# Altium schematic sheet L-Stick_sheet5_power_supply.SchDoc: L-Stick - Power Supply
size A4; DocumentNumber: 5; Revision: 1.0.0; SheetNumber: 5; SheetTotal: 5; DrawnBy: SU; DocumentSize: A4; PCAName: L-Stick
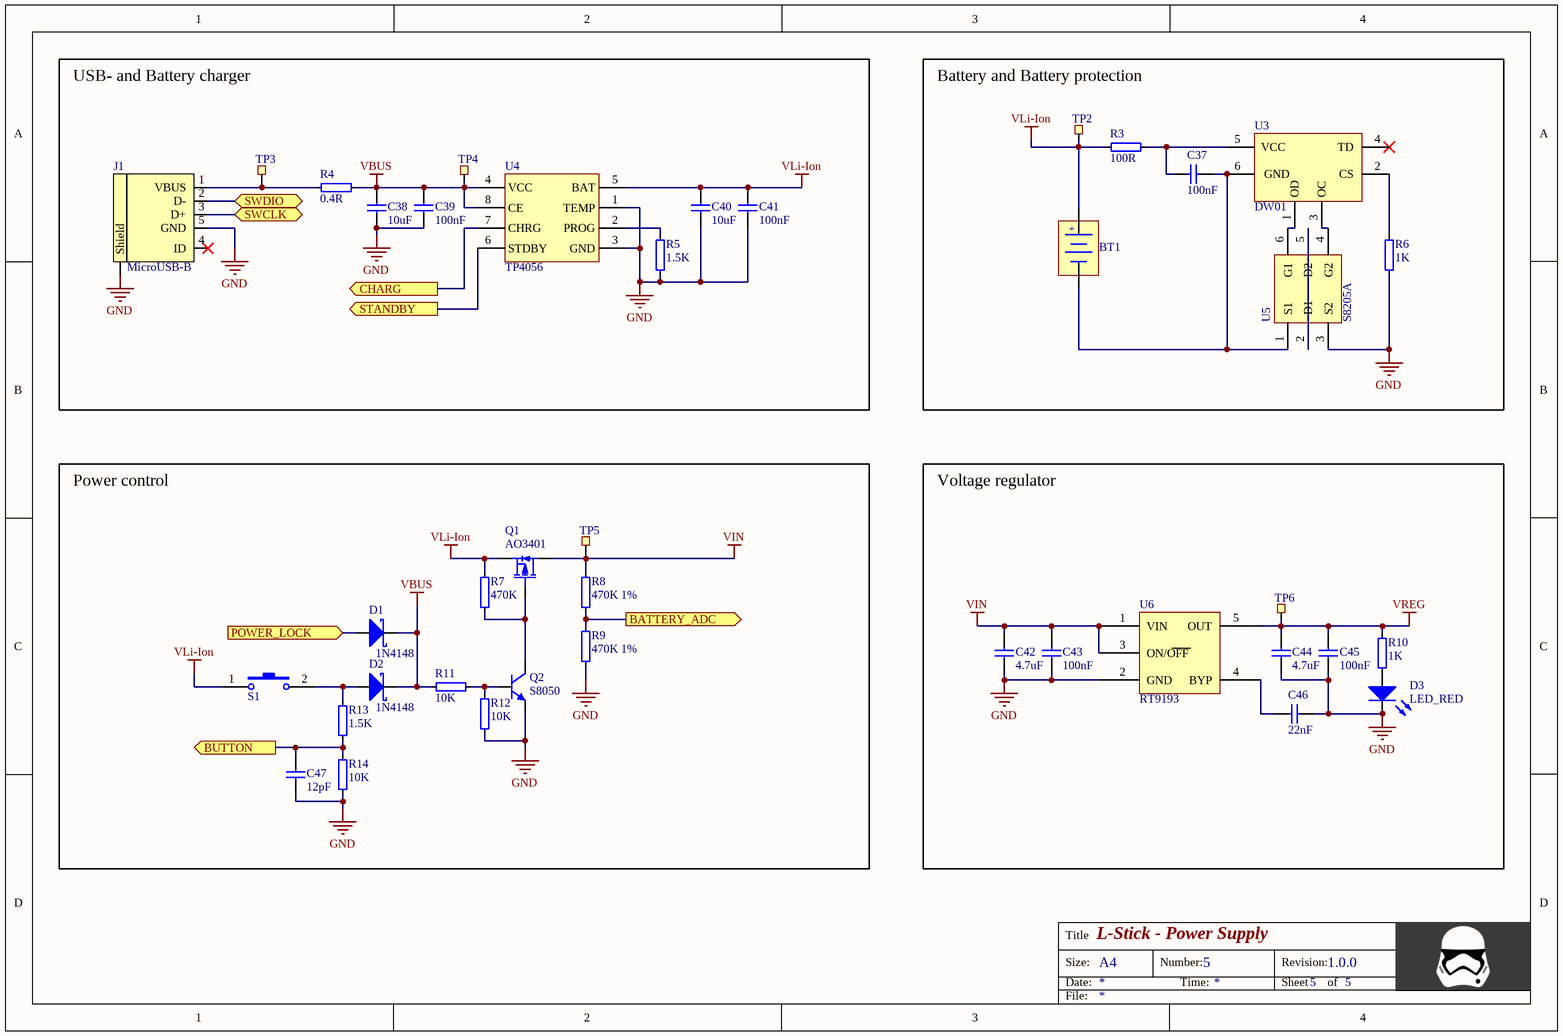
[diagram p0: L-Stick_sheet5_power_supply.SchDoc]

## Parts
BT1  XH2.54_2PIN  [XH2.54_2PIN]  (value not drawn)
C37  100nF  [0402C]
C38  10uF  [0603C]
C39  100nF  [0402C]
C40  10uF  [0603C]
C41  100nF  [0402C]
C42  4.7uF  [0603C]
C43  100nF  [0402C]
C44  4.7uF  [0603C]
C45  100nF  [0402C]
C46  22nF  [0402C]
C47  12pF  [0402C]
D1  1N4148  [SOD-523]
D2  1N4148  [SOD-523]
D3  LED_RED  [LED_RED_0603]
J1  MicroUSB-B  [USB-Micro]
Q1  AO3401  [SOT-23A]
Q2  S8050  [SOT-23A]
R3  100R  [0402R]
R4  0.4R  [1206R]
R5  1.5K  [0402R]
R6  1K  [0402R]
R7  470K  [0402R]
R8  470K 1%  [0402R]
R9  470K 1%  [0402R]
R10  1K  [0402R]
R11  10K  [0402R]
R12  10K  [0402R]
R13  1.5K  [0402R]
R14  10K  [0402R]
S1  Side Button  [SW_SIDE]  (value not drawn)
TP2  Ø1.5mm,SMD  [TP_SMD]  (value not drawn)  (no BOM)
TP3  Ø1.5mm,SMD  [TP_SMD]  (value not drawn)  (no BOM)
TP4  Ø1.5mm,SMD  [TP_SMD]  (value not drawn)  (no BOM)
TP5  Ø1.5mm,SMD  [TP_SMD]  (value not drawn)  (no BOM)
TP6  Ø1.5mm,SMD  [TP_SMD]  (value not drawn)  (no BOM)
U3  DW01  [SOT23-6]
U4  TP4056  [SOIC8E]
U5  S8205A  [SOT23-6]
U6  RT9193  [SOT23-5]

## Blocks framed on the sheet
USB- and Battery charger: C38-C41 J1 R4 R5 TP3 TP4 U4
Battery and Battery protection: BT1 C37 R3 R6 TP2 U3 U5
Power control: C47 D1 D2 Q1 Q2 R7-R9 R11-R14 S1 TP5
Voltage regulator: C42-C46 D3 R10 TP6 U6

## Ports
BATTERY_ADC (out), BUTTON (out), CHARG (out), POWER_LOCK (in), STANDBY (out), SWCLK (bidir), SWDIO (bidir)

## Nets
GND: C38.1 C39.1 C40.1 C41.1 C42.1 C43.1 C44.1 C45.1 C46.2 C47.1 D3.2(K) J1.5(GND) J1.6(Shield) Q2.2(E) R5.1 R6.1 R9.2 R12.2 R14.1 U4.1(TEMP) U4.3(GND) U5.3(S2) U6.2(GND)
VBUS: C38.2 C39.2 D1.2(K) D2.2(K) R4.2 R11.2 TP4.1 U4.4(VCC) U4.8(CE)
VIN: C42.2 C43.2 Q1.3(D) R8.1 TP5.1 U6.1(VIN) U6.3(ON/OFF)
VLi-Ion: BT1.1(+) C40.2 C41.2 Q1.2(S) R3.1 R7.1 S1.1 TP2.1 U4.5(BAT)
VREG: C44.2 C45.2 R10.2 TP6.1 U6.5(OUT)
BATTERY_ADC: R8.2 R9.1 ; port BATTERY_ADC
BUTTON: C47.2 R13.1 R14.2 ; port BUTTON
CHARG: U4.7(CHRG) ; port CHARG
POWER_LOCK: D1.1(A) ; port POWER_LOCK
STANDBY: U4.6(STDBY) ; port STANDBY
SWCLK: J1.3(D+) ; port SWCLK
SWDIO: J1.2(D-) ; port SWDIO
NetBT1_2: BT1.2(-) C37.2 U3.6(GND) U5.1(S1)
NetC37_1: C37.1 R3.2 U3.5(VCC)
NetC46_1: C46.1 U6.4(BYP)
NetD2_1: D2.1(A) R13.2 S1.2
NetD3_1: D3.1(A) R10.1
NetJ1_1: J1.1(VBUS) R4.1 TP3.1
NetQ1_1: Q1.1(G) Q2.3(C) R7.2
NetQ2_1: Q2.1(B) R11.1 R12.1
NetR5_2: R5.2 U4.2(PROG)
NetR6_2: R6.2 U3.2(CS)
NetU3_1: U3.1(OD) U5.6(G1)
NetU3_3: U3.3(OC) U5.4(G2)
NetU5_2: U5.2(D1) U5.5(D2)

Not connected (* = marked no-connect by the designer): J1 4(ID)*; U3 4(TD)*

## Notes on the sheet
- Title
- Size:
- Date:
- A4
- Number:
- Time:
- Revision:
- Sheet
- of
- File:

## Library data of the parts
BT1 = Battery: Multicell Battery Base; Value: XH2.54_2PIN
C37 C39 C41 C43 C45-C47 = CAP_0402: Capacitor
  C37 C39 C41 C43 C45: Value: 100nF
  C46: Value: 22nF
  C47: Value: 12pF
C38 C40 C42 C44 = CAP_0603: Capacitor
  C38 C40: Value: 10uF
  C42 C44: Value: 4.7uF
D1 D2 = Diode Schottky: Value: 1N4148
J1 = MiniUSB-AB-SMT: MicroUSB-B-SMT; Value: MicroUSB-B
Q1 = MOSFET-P: P-MOS, AO3401, P-Channel MOSFET; Value: AO3401
Q2 = NPN: NPN, S8050, NPN Bipolar Transistor; Value: S8050
R3 R5-R14 = RES_0402: Resistor
  R3: Value: 100R
  R5 R13: Value: 1.5K
  R6 R10: Value: 1K
  R7: Value: 470K
  R8 R9: Value: 470K 1%
  R11 R12 R14: Value: 10K
R4 = RES_1206: Resistor; Value: 0.4R
S1 = SW-PB: Value: Side Button
TP2-TP6 = TP_SMD_Ø1.0MM: 1.0mm circular SMD testpad; Value: Ø1.5mm,SMD
U3 = DW01: Chip, DW01, Battery Protection IC; Value: DW01
U4 = TP4056: Chip, TP4056, Battery charging chip; Value: TP4056
U5 = S8205A: Chip, S8205A; Value: S8205A
U6 = RT9193: Chip, RT9193, LDO Regulator; Value: RT9193
D3 = LED_RED: Value: LED_RED